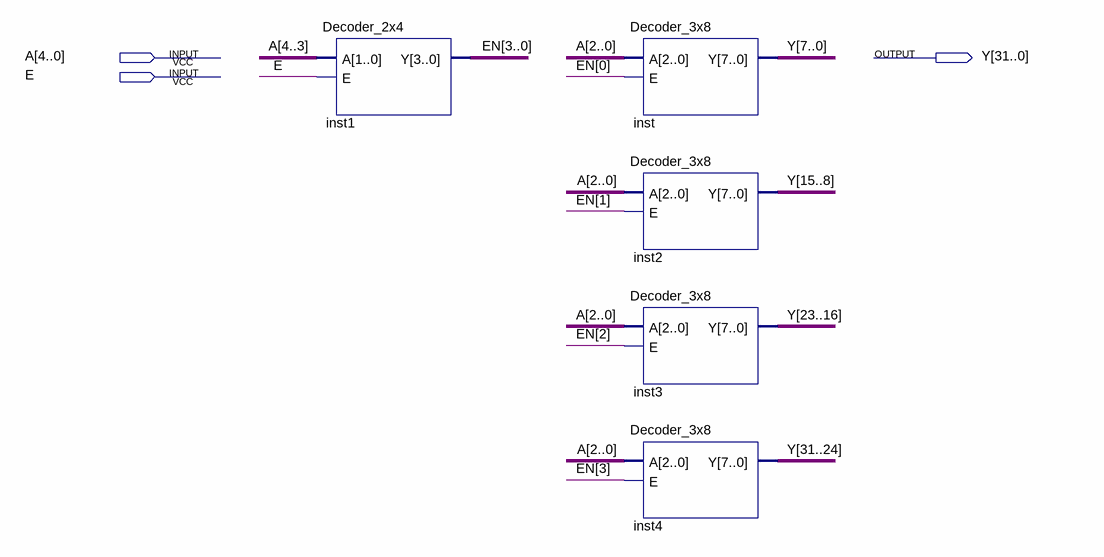
[diagram p0: schematic sheet]
// Quartus schematic Decoder_5x32.bdf as structural Verilog: 5 symbols, 3 pins
module Decoder_5x32 (
  input  [4:0] A,
  input  E,
  output [31:0] Y
);

  wire [3:0] EN;

  Decoder_2x4 inst1 (.A(A[4:3]), .E(E), .Y(EN));
  Decoder_3x8 inst (.A(A[2:0]), .E(EN[0]), .Y(Y[7:0]));
  Decoder_3x8 inst2 (.A(A[2:0]), .E(EN[1]), .Y(Y[15:8]));
  Decoder_3x8 inst3 (.A(A[2:0]), .E(EN[2]), .Y(Y[23:16]));
  Decoder_3x8 inst4 (.A(A[2:0]), .E(EN[3]), .Y(Y[31:24]));
endmodule
